# Altium schematic sheet mAIN 2.SchDoc
size A; SheetNumber: 3; SheetTotal: 3
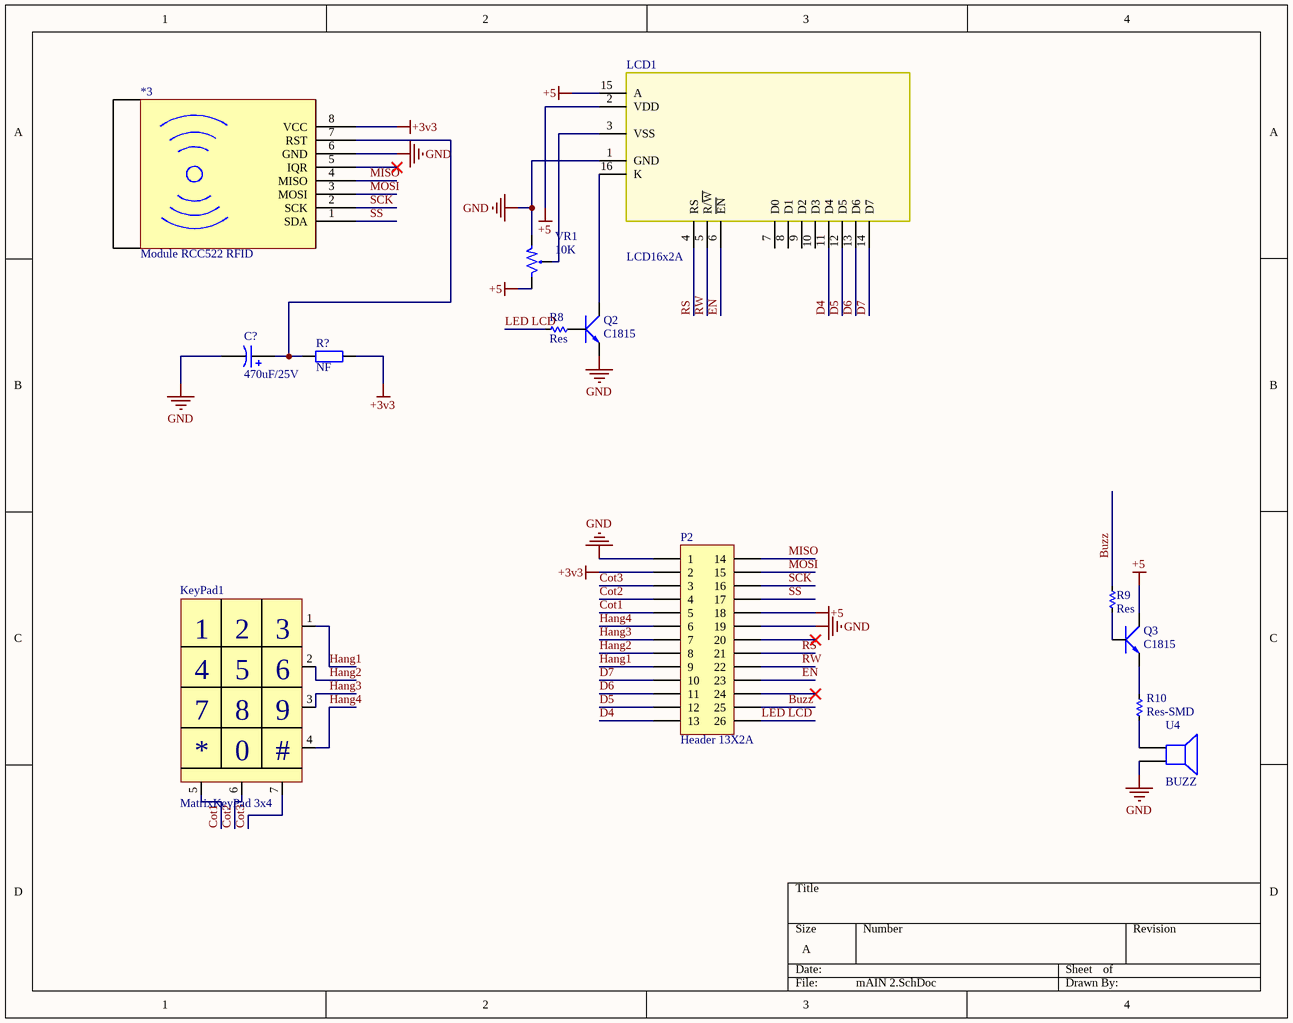
[diagram p0: mAIN 2.SchDoc]

## Parts
*3  Module RCC522 RFID  [Module RCC522 RFID]
C?  470uF/25V  [CAP_ALUM_D100_S50_H200]
KeyPad1  MatrixKeyPad 3x4  [MatrixKeyPad(3x4)]
LCD1  LCD16x2A  [LCD16X2]
P2  Header 13X2A  [HDR2X13_CEN]
Q2  C1815  [QTO-92]
Q3  C1815  [QTO-92]
R8  Res  [RES-1/4W-SMALL]
R9  Res  [RES-1/4W-SMALL]
R10  Res-SMD  [RES-SMD-0805]
R?  NF  [RESC-0603 (1608)]
U4  BUZZ  [BUZZER_through_hole]
VR1  10K  [VR]

## Nets
+3v3: *3.8(VCC) P2.2 R?.2
+5: LCD1.2(VDD) LCD1.15(A) P2.18 Q3.2(C) VR1.3
GND: *3.6(GND) C?.2 LCD1.1(GND) P2.1 P2.19 Q2.1(E) U4.2 VR1.1
Buzz: P2.25 R9.2
Cot1: KeyPad1.5 P2.5
Cot2: KeyPad1.6 P2.4
Cot3: KeyPad1.7 P2.3
D4: LCD1.11(D4) P2.13
D5: LCD1.12(D5) P2.12
D6: LCD1.13(D6) P2.11
D7: LCD1.14(D7) P2.10
EN: LCD1.6(~{EN}) P2.23
Hang1: KeyPad1.1 P2.9
Hang2: KeyPad1.2 P2.8
Hang3: KeyPad1.3 P2.7
Hang4: KeyPad1.4 P2.6
LED LCD: P2.26 R8.2
MISO: *3.4(MISO) P2.14
MOSI: *3.3(MOSI) P2.15
RS: LCD1.4(RS) P2.21
RW: LCD1.5(R/~{W}) P2.22
SCK: *3.2(SCK) P2.16
SS: *3.1(SDA) P2.17
Net*3_7: *3.7(RST) C?.1 R?.1
NetLCD1_3: LCD1.3(VSS) VR1.2
NetLCD1_16: LCD1.16(K) Q2.2(C)
NetQ2_3: Q2.3(B) R8.1
NetQ3_1: Q3.1(E) R10.1
NetQ3_3: Q3.3(B) R9.1
NetR10_2: R10.2 U4.1

Not connected (* = marked no-connect by the designer): *3 5(IQR)*; LCD1 7(D0) 8(D1) 9(D2) 10(D3); P2 20* 24*

## Notes on the sheet
- (in symbol MatrixKeyPad 3x4) 8; 9; 0; #

## Library data of the parts
C? = 25NA470MEFC10X20: CAP ALUM 470uF 20% 25V RADIAL; Solder: WAVE; CompanyID: VT-00047; MPN: 25NA470MEFC10X20; Value: 470uF/25V; Category: CAPACITOR; PinCount: 2
LCD1 = LCD16x2: LCD dipslay 16 char, 2 line; Value: LCD16x2A
P2 = Header 13X2A: Header, 13-Pin, Dual row; Solder: WAVE
Q2 Q3 = C1815: NPN 600mW, ECB; Value: C1815
R8 R9 = Res: Manufacturer: Generic Components; Class: Passive; SubClass: R; Published: 08/06/2000; Publisher: Altium Hobart Technology Centre
R10 = Res-SMD: Resistor; Manufacturer: Generic Components; Class: Passive; Published: 08/06/2000; Publisher: Altium Hobart Technology Centre
R? = RESC NF 0603: RES SMD, Not Fill, 0603; Solder: Not Fill; Value: NF; Category: RESISTOR
U4 = Speaker: Loudspeaker
VR1 = VR1: Var Resistor; Value: VR 10K